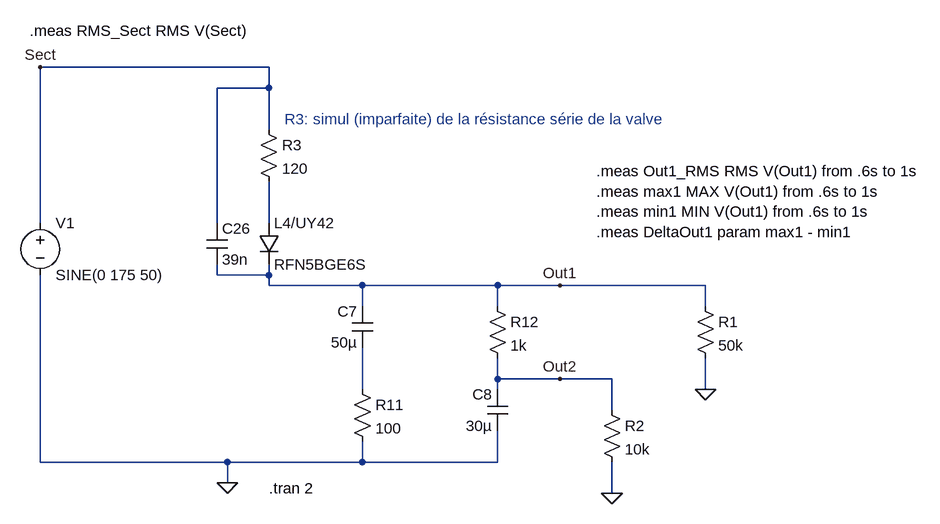
[diagram p0: schematic AlimPhilettaBF102A.asc]
AlimPhilettaBF102A.asc, the LTspice schematic file:
Version 4
SHEET 1 1412 680
WIRE 384 -96 32 -96
WIRE 384 -64 384 -96
WIRE 384 -64 304 -64
WIRE 384 0 384 -64
WIRE 32 144 32 -96
WIRE 304 144 304 -64
WIRE 384 144 384 80
WIRE 304 224 304 208
WIRE 384 224 384 208
WIRE 384 224 304 224
WIRE 384 240 384 224
WIRE 528 240 384 240
WIRE 736 240 528 240
WIRE 832 240 736 240
WIRE 1056 240 832 240
WIRE 528 272 528 240
WIRE 736 272 736 240
WIRE 1056 272 1056 240
WIRE 736 384 736 352
WIRE 832 384 736 384
WIRE 912 384 832 384
WIRE 528 400 528 336
WIRE 736 400 736 384
WIRE 1056 400 1056 352
WIRE 912 432 912 384
WIRE 32 512 32 224
WIRE 320 512 32 512
WIRE 528 512 528 480
WIRE 528 512 320 512
WIRE 736 512 736 464
WIRE 736 512 528 512
WIRE 320 544 320 512
WIRE 912 560 912 512
FLAG 320 544 0
FLAG 832 240 Out1
FLAG 832 384 Out2
FLAG 912 560 0
FLAG 1056 400 0
FLAG 32 -96 Sect
SYMBOL voltage 32 128 R0
WINDOW 123 0 0 Left 0
WINDOW 39 0 0 Left 0
SYMATTR InstName V1
SYMATTR Value SINE(0 175 50)
SYMBOL diode 368 144 R0
SYMATTR InstName L4/UY42
SYMATTR Value RFN5BGE6S
SYMBOL cap 288 144 R0
SYMATTR InstName C26
SYMATTR Value 39n
SYMBOL cap 544 336 R180
WINDOW 0 24 56 Left 2
WINDOW 3 24 8 Left 2
SYMATTR InstName C7
SYMATTR Value 50µ
SYMBOL cap 752 464 R180
WINDOW 0 24 56 Left 2
WINDOW 3 24 8 Left 2
SYMATTR InstName C8
SYMATTR Value 30µ
SYMBOL res 720 256 R0
SYMATTR InstName R12
SYMATTR Value 1k
SYMBOL res 512 384 R0
SYMATTR InstName R11
SYMATTR Value 100
SYMBOL res 1040 256 R0
SYMATTR InstName R1
SYMATTR Value 50k
SYMBOL res 896 416 R0
SYMATTR InstName R2
SYMATTR Value 10k
SYMBOL res 368 -16 R0
SYMATTR InstName R3
SYMATTR Value 120
TEXT 384 552 Left 2 !.tran 2
TEXT 888 64 Left 2 !.meas Out1_RMS RMS V(Out1) from .6s to 1s\n.meas max1 MAX V(Out1) from .6s to 1s\n.meas min1 MIN V(Out1) from .6s to 1s\n.meas DeltaOut1 param max1 - min1
TEXT 408 -16 Left 2 ;R3: simul (imparfaite) de la résistance série de la valve
TEXT 16 -152 Left 2 !.meas RMS_Sect RMS V(Sect)

The netlist it stands for:
* AlimPhilettaBF102A.asc
V1 Sect 0 SINE(0 175 50)
D§L4/UY42 N001 Out1 RFN5BGE6S
C26 Sect Out1 39n
C7 N002 Out1 50µ
C8 0 Out2 30µ
R12 Out1 Out2 1k
R11 N002 0 100
R1 Out1 0 50k
R2 Out2 0 10k
R3 Sect N001 120
.model D D
.lib standard.dio
.tran 2
.meas Out1_RMS RMS V(Out1) from .6s to 1s
.meas max1 MAX V(Out1) from .6s to 1s
.meas min1 MIN V(Out1) from .6s to 1s
.meas DeltaOut1 param max1 - min1
* R3: simul (imparfaite) de la résistance série de la valve
.meas RMS_Sect RMS V(Sect)
.backanno
.end